# EAGLE design Group 1-1_PP (EAGLE 9.6.2)

## Sheet 1 of 2
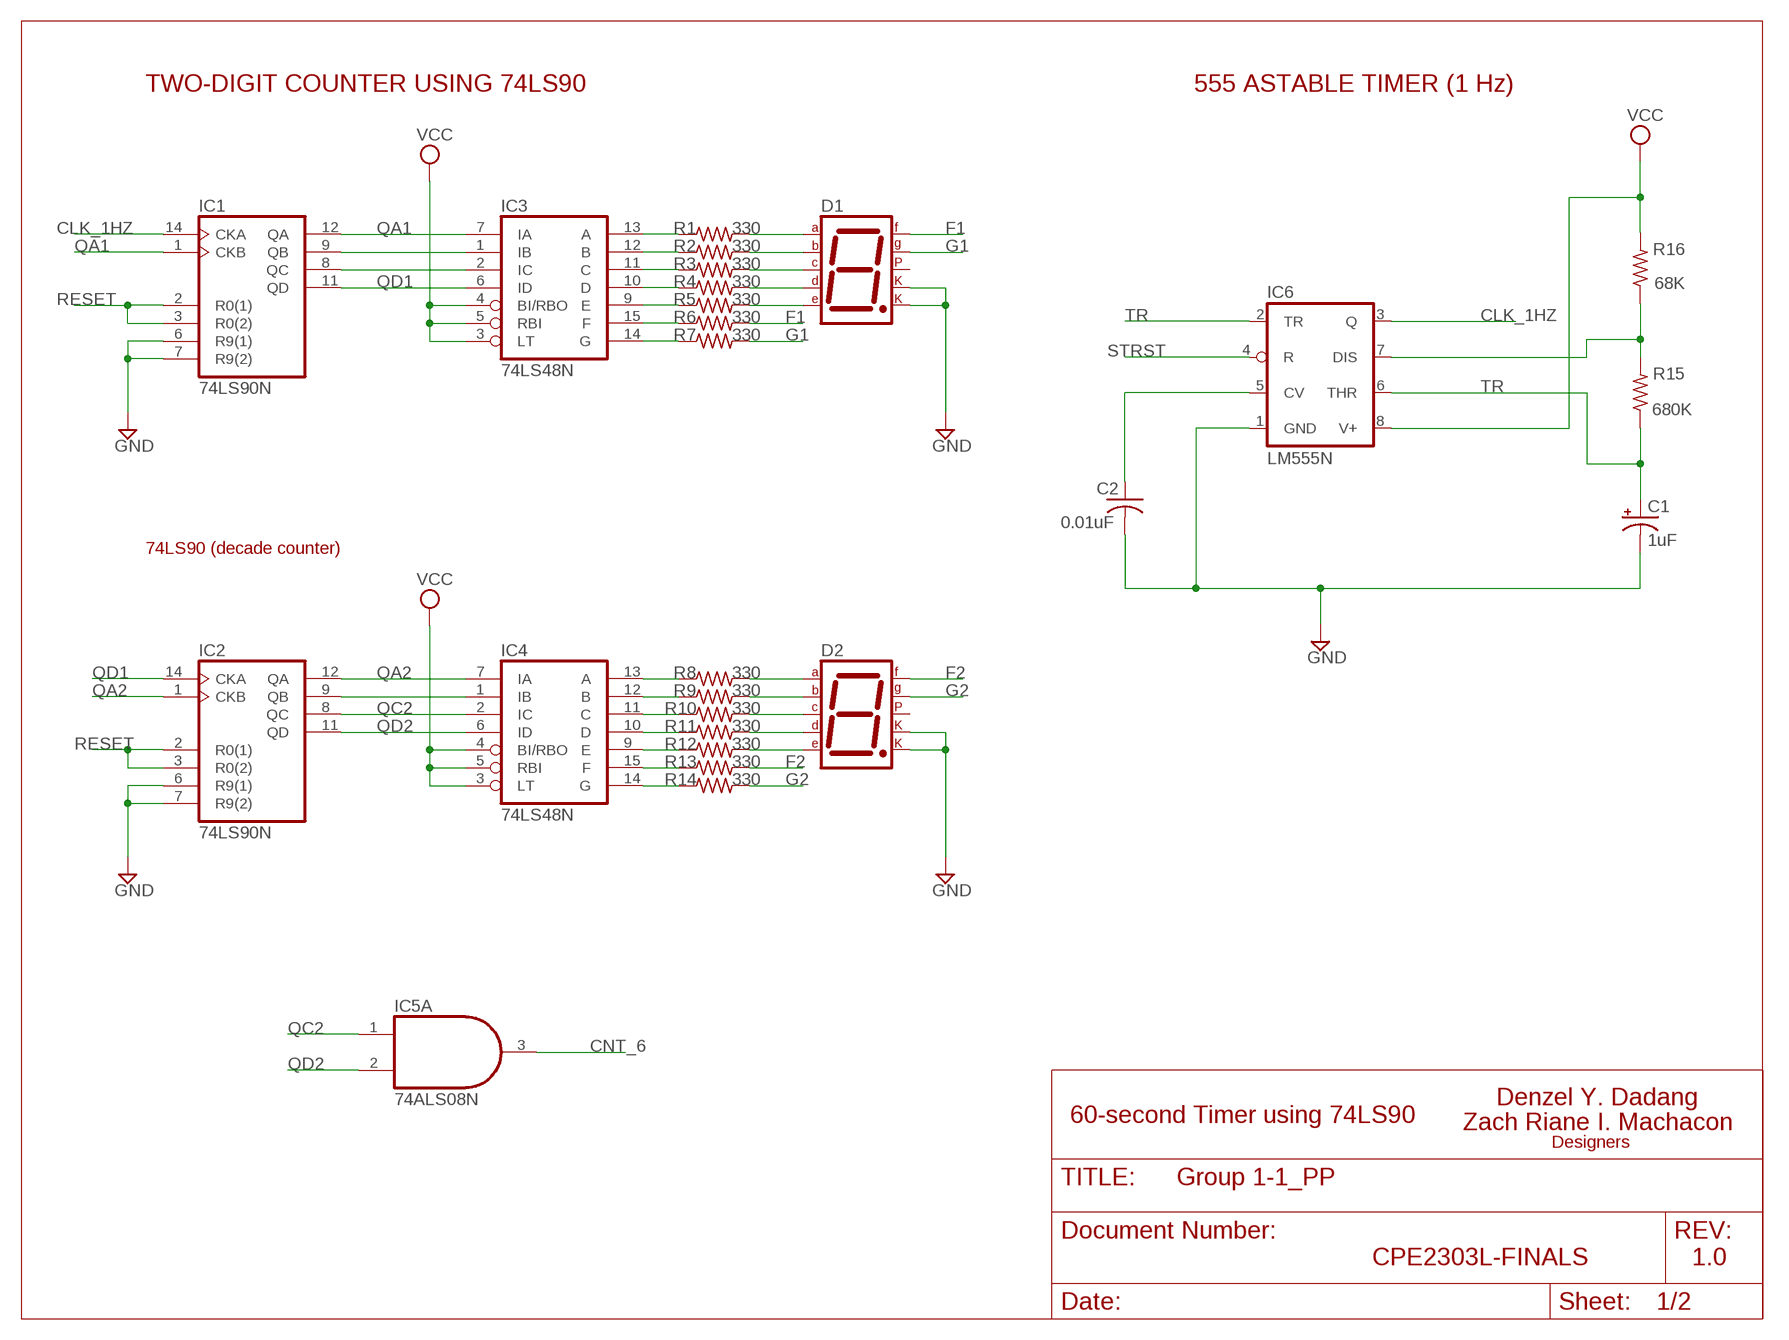
[diagram p0: schematic, sheet 1]

### Parts
C1  1uF  CPOL-USE1.8-4  [E1,8-4]
C2  0.01uF  C-US025-025X050  [C025-025X050]
D1  7SEG-CK  [7SEG-13]
D2  7SEG-CK  [7SEG-13]
IC1  74LS90N  [DIL14]
IC2  74LS90N  [DIL14]
IC3  74LS48N  [DIL16]
IC4  74LS48N  [DIL16]
IC5  74ALS08N  [DIL14]
IC6  LM555N  [DIL08]
R1  330  R-US_0204/7  [0204/7]
R2  330  R-US_0204/7  [0204/7]
R3  330  R-US_0204/7  [0204/7]
R4  330  R-US_0204/7  [0204/7]
R5  330  R-US_0204/7  [0204/7]
R6  330  R-US_0204/7  [0204/7]
R7  330  R-US_0204/7  [0204/7]
R8  330  R-US_0204/7  [0204/7]
R9  330  R-US_0204/7  [0204/7]
R10  330  R-US_0204/7  [0204/7]
R11  330  R-US_0204/7  [0204/7]
R12  330  R-US_0204/7  [0204/7]
R13  330  R-US_0204/7  [0204/7]
R14  330  R-US_0204/7  [0204/7]
R15  680K  R-US_0204/7  [0204/7]
R16  68K  R-US_0204/7  [0204/7]

### Nets
CLK_1HZ: IC1.14(CKA) IC6.3(Q)
CNT_6: IC5.3(A:O) ; also sheet 2
F1: D1.9(F) R6.2
F2: D2.9(F) R13.2
G1: D1.10(G) R7.2
G2: D2.10(G) R14.2
GND: C1.- C2.2 D1.3(CK1) D1.8(CK2) D2.3(CK1) D2.8(CK2) IC1.6(R9(1)) IC1.7(R9(2)) IC2.6(R9(1)) IC2.7(R9(2)) IC6.1(GND) ; also sheet 2
N$6: IC3.13(A) R1.1
N$7: IC6.7(DIS) R15.2 R16.1
N$8: IC1.9(QB) IC3.1(IB)
N$9: C2.1 IC6.5(CV)
N$10: IC1.8(QC) IC3.2(IC)
N$11: IC3.12(B) R2.1
N$12: IC3.11(C) R3.1
N$13: IC3.10(D) R4.1
N$14: IC3.9(E) R5.1
N$15: IC3.15(F) R6.1
N$16: IC3.14(G) R7.1
N$17: IC4.13(A) R8.1
N$18: IC2.9(QB) IC4.1(IB)
N$19: D1.1(E) R5.2
N$20: D1.2(D) R4.2
N$21: D1.4(C) R3.2
N$22: D1.6(B) R2.2
N$23: D1.7(A) R1.2
N$24: IC4.12(B) R9.1
N$25: IC4.11(C) R10.1
N$26: IC4.10(D) R11.1
N$27: IC4.9(E) R12.1
N$28: IC4.15(F) R13.1
N$29: IC4.14(G) R14.1
N$30: D2.7(A) R8.2
N$31: D2.6(B) R9.2
N$32: D2.4(C) R10.2
N$33: D2.2(D) R11.2
N$34: D2.1(E) R12.2
QA1: IC1.1(CKB) IC1.12(QA) IC3.7(IA)
QA2: IC2.1(CKB) IC2.12(QA) IC4.7(IA)
QC2: IC2.8(QC) IC4.2(IC) IC5.1(A:I0)
QD1: IC1.11(QD) IC2.14(CKA) IC3.6(ID)
QD2: IC2.11(QD) IC4.6(ID) IC5.2(A:I1)
RESET: IC1.2(R0(1)) IC1.3(R0(2)) IC2.2(R0(1)) IC2.3(R0(2)) ; also sheet 2
STRST: IC6.4(R) ; also sheet 2
TR: C1.+ IC6.2(TR) IC6.6(THR) R15.1
VCC: IC3.3(LT) IC3.4(BI/RBO) IC3.5(RBI) IC4.3(LT) IC4.4(BI/RBO) IC4.5(RBI) IC6.8(V+) R16.2 ; also sheet 2
Unconnected: D1.5(DP) D2.5(DP) IC5.4(B:I0) IC5.5(B:I1) IC5.6(B:O) IC5.8(C:O) IC5.9(C:I0) IC5.10(C:I1) IC5.11(D:O) IC5.12(D:I0) IC5.13(D:I1)

### Notes on the sheet
- TWO-DIGIT COUNTER USING 74LS90 | 555 ASTABLE TIMER (1 Hz)
- 74LS90 (decade counter)
- Denzel Y. Dadang
- 60-second Timer using 74LS90
- Zach Riane I. Machacon
- Designers
- CPE2303L-FINALS | 1.0

## Sheet 2 of 2
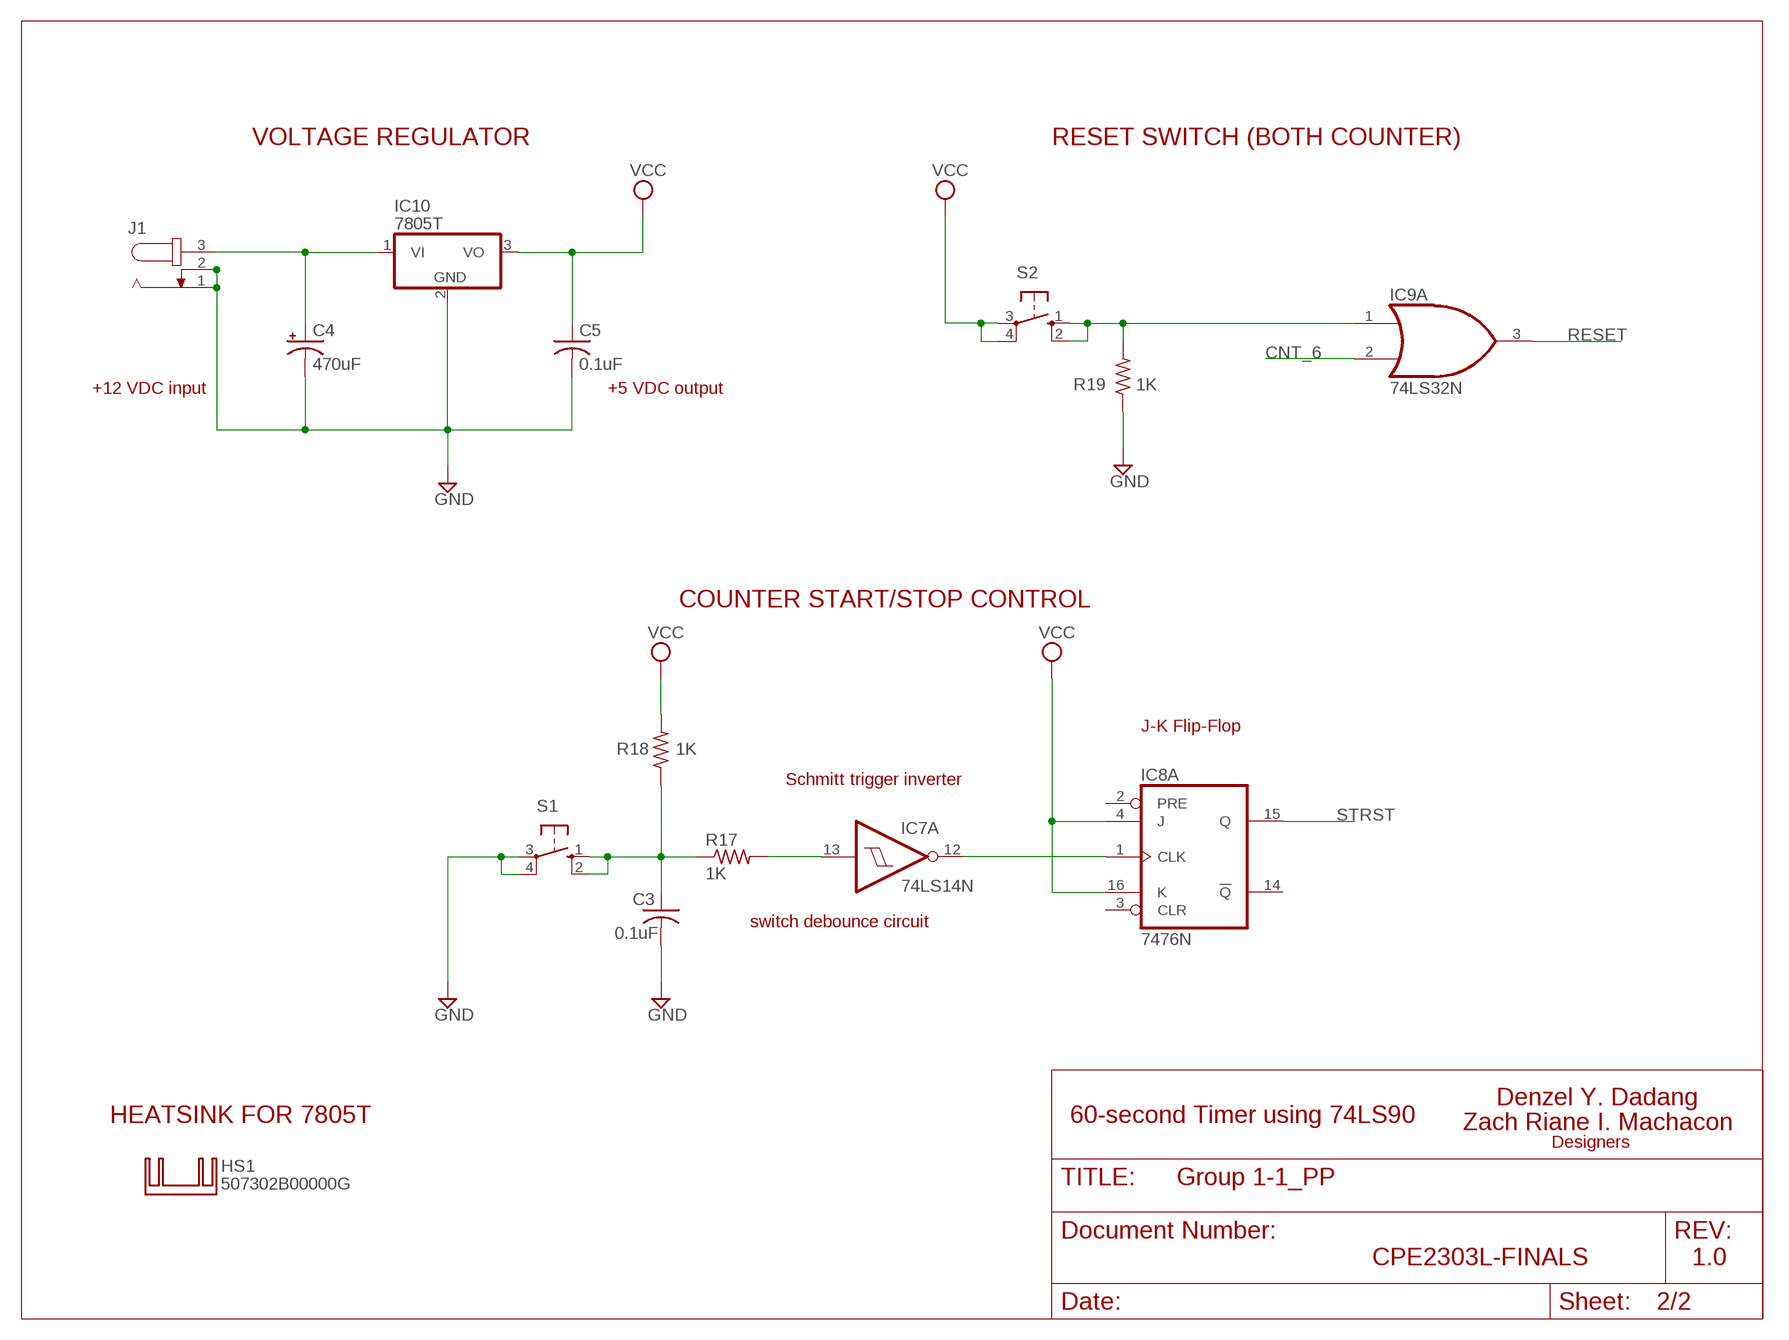
[diagram p1: schematic, sheet 2]

### Parts
C3  0.1uF  C-US025-025X050  [C025-025X050]
C4  470uF  CPOL-USE1.8-4  [E1,8-4]
C5  0.1uF  C-US025-025X050  [C025-025X050]
HS1  507302B00000G  [TO-220H]
IC7  74LS14N  [DIL14]
IC8  7476N  [DIL16]
IC9  74LS32N  [DIL14]
IC10  7805T  [TO220H]
J1  JACK-PLUG1  [SPC4078]
R17  1K  R-US_0204/7  [0204/7]
R18  1K  R-US_0204/7  [0204/7]
R19  1K  R-US_0204/7  [0204/7]
S1  10-XX  [B3F-10XX]
S2  10-XX  [B3F-10XX]

### Nets
CNT_6: IC9.2(A:I1) ; also sheet 1
GND: C3.2 C4.- C5.2 IC10.2(GND) J1.1 J1.2 R19.1 S1.3(P) S1.4(P1) ; also sheet 1
N$1: C4.+ IC10.1(VI) J1.3
N$2: IC7.12(A:O) IC8.1(A:CLK)
N$3: IC7.13(A:I) R17.2
N$4: C3.1 R17.1 R18.1 S1.1(S) S1.2(S1)
N$5: IC9.1(A:I0) R19.2 S2.1(S) S2.2(S1)
RESET: IC9.3(A:O) ; also sheet 1
STRST: IC8.15(A:Q) ; also sheet 1
VCC: C5.1 IC8.4(A:J) IC8.16(A:K) IC10.3(VO) R18.2 S2.3(P) S2.4(P1) ; also sheet 1
Unconnected: IC7.1(D:I) IC7.2(D:O) IC7.3(E:I) IC7.4(E:O) IC7.5(F:I) IC7.6(F:O) IC7.8(C:O) IC7.9(C:I) IC7.10(B:O) IC7.11(B:I) IC8.2(A:PRE) IC8.3(A:CLR) IC8.6(B:CLK) IC8.7(B:PRE) IC8.8(B:CLR) IC8.9(B:J) IC8.10(B:!Q) IC8.11(B:Q) IC8.12(B:K) IC8.14(A:!Q) IC9.4(B:I0) IC9.5(B:I1) IC9.6(B:O) IC9.8(C:O) IC9.9(C:I0) IC9.10(C:I1) IC9.11(D:O) IC9.12(D:I0) IC9.13(D:I1)

### Notes on the sheet
- VOLTAGE REGULATOR | RESET SWITCH (BOTH COUNTER)
- +12 VDC input | +5 VDC output
- COUNTER START/STOP CONTROL
- J-K Flip-Flop
- Schmitt trigger inverter
- switch debounce circuit
- Denzel Y. Dadang
- HEATSINK FOR 7805T | 60-second Timer using 74LS90
- Zach Riane I. Machacon
- Designers
- CPE2303L-FINALS | 1.0

## Power pins joined to a net without a drawn wire
GND: IC1.10(GND) IC2.10(GND) IC3.8(GND) IC4.8(GND) IC5.7(P:GND) IC7.7(P:GND) IC8.13(P:GND) IC9.7(P:GND)
VCC: IC1.5(VCC) IC2.5(VCC) IC3.16(VCC) IC4.16(VCC) IC5.14(P:VCC) IC7.14(P:VCC) IC8.5(P:VCC) IC9.14(P:VCC)

## Library data of the parts
C1 C4 = rcl:CPOL-US: POLARIZED CAPACITOR, American symbol; SPICEPREFIX: C
C2 C3 C5 = rcl:C-US: CAPACITOR, American symbol; SPICEPREFIX: C
D1 D2 = special:7SEG-CK: 7-segment DISPLAY single cathode, 13 mm
HS1 = to220-heatsink:507302B00000G
IC1 IC2 = 74xx-us:74*90: Decade, divide by twelve and binary COUNTER
IC3 IC4 = 74xx-us:74*48: BCD to seven segment DECODER/DRIVER
IC5 = 74xx-us:74*08: Quad 2-input AND gate
IC6 = linear:*555: TIMER
IC7 = 74xx-us:74*14: Hex schmitt trigger INVERTER
IC8 = 74xx-us:74*76: Dual J-K FLIP FLOP, preset and clear
IC9 = 74xx-us:74*32: Quad 2-input OR gate
IC10 = linear:78*: Positive VOLTAGE REGULATOR Source: http://cache.national.com/ds/LM/LM78L05.pdf http://www.fairchildsemi.com/ds/LM/LM7805.pdf
J1 = con-jack:JACK-PLUG: DC POWER JACK Power Jack, DC, Right Angle, Through Hole, Rated 5A at 16VDC, PC Terminals Distributor: Farnell (www.Farnell.de) Drawing: 84N1161.pdf / 84N1162.pdf Manufacturer: SPC Technology (www.spctechnology.com) Type: SPC4077 / SPC 4078; OC_FARNELL: unknown; OC_NEWARK: unknown
R1-R19 = rcl:R-US_: RESISTOR, American symbol; SPICEPREFIX: R
S1 S2 = switch-omron:10-XX: OMRON SWITCH; MPN: B3F-1000; OC_FARNELL: 176432; OC_NEWARK: 36M3542

## Board
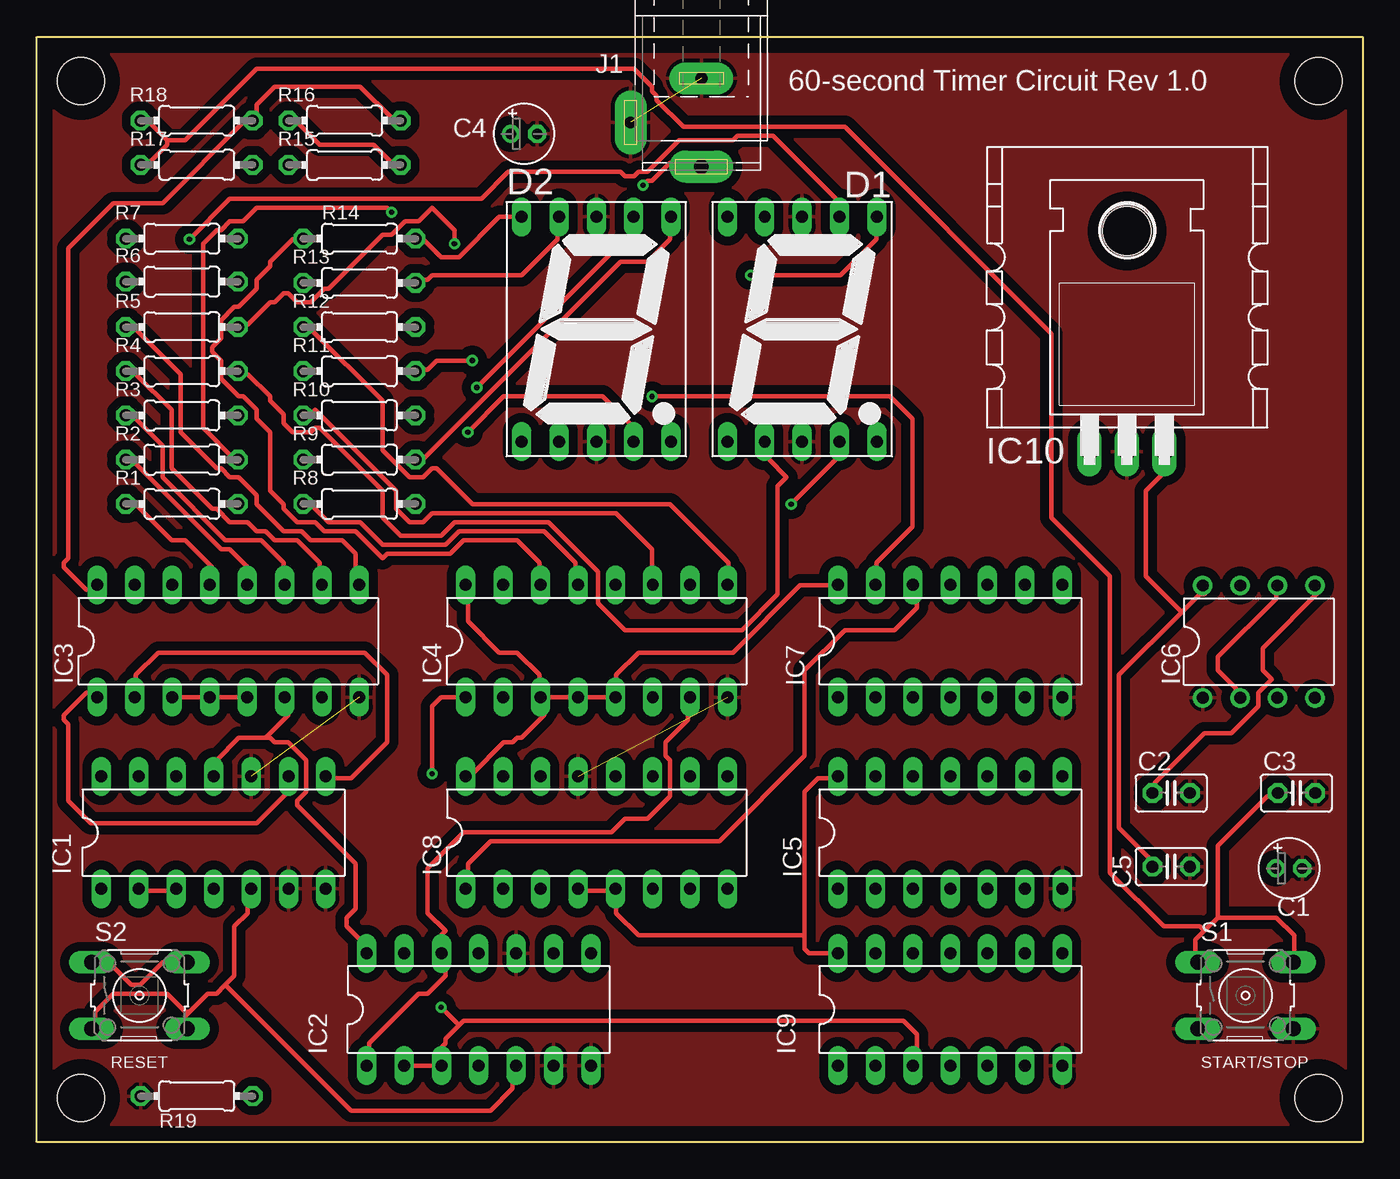
[diagram p2: board, top side]
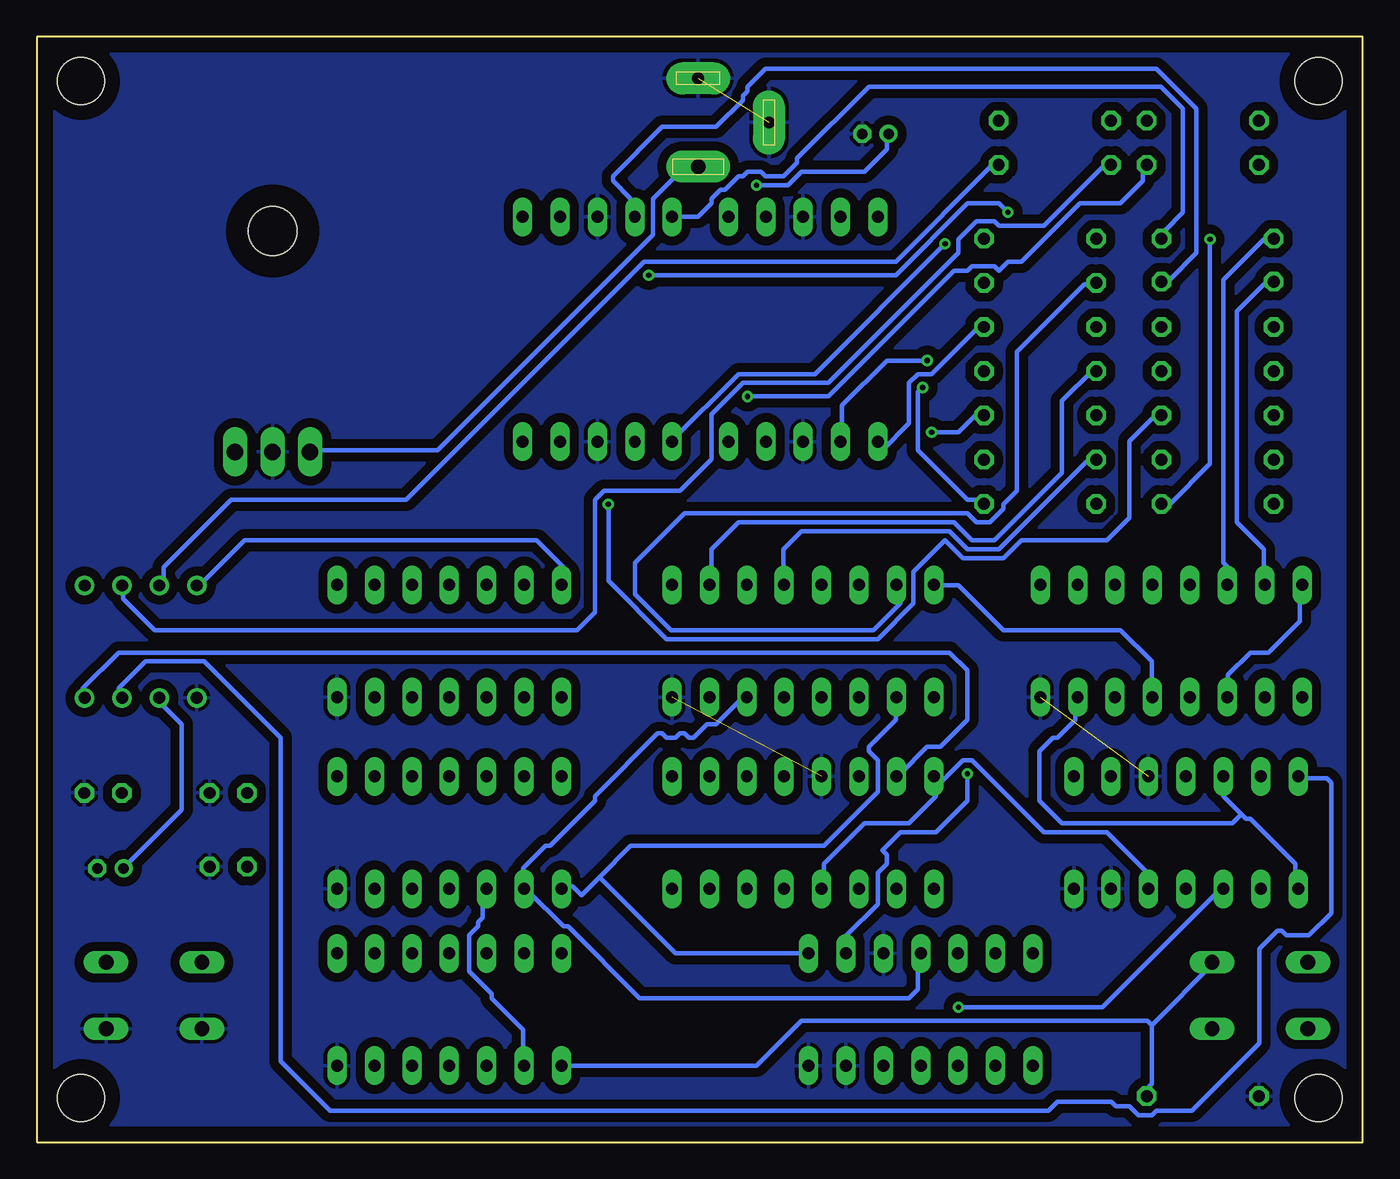
[diagram p3: board, bottom side, seen from below]

Size 90 x 75 mm. Coordinates in mm from the lower left corner, seen from the top.
Outline: 0,0 0,75 90,75 90,0 0,0
Copper layers (1*16): Top 0.035mm / dielectric 1.53mm / Bottom 0.035mm
Design rules "default *": minimum track width 12mil, minimum drill 0.35mm, track to track 12mil, track to pad 12mil, pad to pad 12mil, via to via 12mil, smd to smd 12mil, copper to edge 40mil, drill to drill 8mil, minimum pad ring 10mil, minimum via ring 8mil, stop-mask expansion 4mil, vias tented up to drill 0mil, thermal gap 10mil
Holes 3.2 mm at 3,72 3,3 87,3 87,72

### Footprints (pad centres in the part's own frame; a part is rotated, then mirrored left to right if it is on the bottom)
E1,8-4 = drill 0.711 pad 1.168: + -0.889,0 | drill 0.711 pad 1.168 octagon: - 0.889,0
C025-025X050 = drill 0.813 octagon: 1 -1.27,0; 2 1.27,0
7SEG-13 = drill 0.813 long: 1 -5.08,-7.62; 2 -2.54,-7.62; 3 0,-7.62; 4 2.54,-7.62; 5 5.08,-7.62; 6 5.08,7.62; 7 2.54,7.62; 8 0,7.62; 9 -2.54,7.62; 10 -5.08,7.62
DIL14 = drill 0.813 long: 1 -7.62,-3.81; 2 -5.08,-3.81; 3 -2.54,-3.81; 4 0,-3.81; 5 2.54,-3.81; 6 5.08,-3.81; 7 7.62,-3.81; 8 7.62,3.81; 9 5.08,3.81; 10 2.54,3.81; 11 0,3.81; 12 -2.54,3.81; 13 -5.08,3.81; 14 -7.62,3.81
DIL16 = drill 0.813 long: 1 -8.89,-3.81; 2 -6.35,-3.81; 3 -3.81,-3.81; 4 -1.27,-3.81; 5 1.27,-3.81; 6 3.81,-3.81; 7 6.35,-3.81; 8 8.89,-3.81; 9 8.89,3.81; 10 6.35,3.81; 11 3.81,3.81; 12 1.27,3.81; 13 -1.27,3.81; 14 -3.81,3.81; 15 -6.35,3.81; 16 -8.89,3.81
DIL08 = drill 0.813 pad 1.27: 1 -3.81,-3.81; 2 -1.27,-3.81; 3 1.27,-3.81; 4 3.81,-3.81; 5 3.81,3.81; 6 1.27,3.81; 7 -1.27,3.81; 8 -3.81,3.81
TO220H = drill 1.118 long: 1 -2.54,-10.16; 2 0,-10.16; 3 2.54,-10.16 | hole 3.302: 0,4.826
SPC4078 = drill 0.8 pad 2.184 long: 1 -3,0; 2 0,-4.8 | drill 1 pad 2.184 long: 3 3,0
0204/7 = drill 0.813 octagon: 1 -3.81,0; 2 3.81,0
B3F-10XX = drill 1.016 long: 1 -3.251,2.261; 2 3.251,2.261; 3 -3.251,-2.261; 4 3.251,-2.261

### Placement (x,y rotation side)
C1  85,18.58 0 top
C2  77,23.69 0 top
C3  85.5,23.69 0 top
C4  33.07,68.42 0 top
C5  77,18.69 0 top
D1  51.95,55.16 0 top
D2  37.98,55.16 0 top
HS1  64.5,58 270 top
IC1  12,21 0 top
IC2  30,9 0 top
IC3  13,34 0 top
IC4  38,34 0 top
IC5  62,21 0 top
IC6  82.95,33.96 0 top
IC7  62,34 0 top
IC8  38,21 0 top
IC9  62,9 0 top
IC10  74,57 0 top
J1  45.11,69.19 270 top
R1  9.85,43.31 0 top
R2  9.85,46.31 0 top
R3  9.85,49.31 0 top
R4  9.85,52.31 0 top
R5  9.85,55.31 0 top
R6  9.85,58.39 0 top
R7  9.85,61.31 0 top
R8  21.9,43.31 0 top
R9  21.9,46.31 0 top
R10  21.9,49.31 0 top
R11  21.9,52.31 0 top
R12  21.9,55.31 0 top
R13  21.9,58.31 0 top
R14  21.9,61.31 0 top
R15  20.9,66.31 0 top
R16  20.9,69.31 0 top
R17  10.85,66.31 0 top
R18  10.85,69.31 0 top
R19  10.86,3.13 0 top
S1  82.04,9.96 0 top
S2  6.97,9.96 0 top

### Tracks (layer width: path | path; a pad name or v marks a point on that pad's centre or on a via)
CLK_1HZ
  Bottom 0.305: IC1.14 4.27,24.69 2.44,24.69 2.13,24.38 2.13,15.54 3.66,14.02 5.18,14.02 5.49,14.33 5.79,14.33 7.01,13.11 7.01,6.71 11.58,2.13 14.02,2.13 14.33,1.83 15.24,1.83 15.85,2.44 16.76,2.44 17.07,2.74 20.73,2.74 21.34,2.13 70.1,2.13 73.46,5.49 73.46,27.43 78.64,32.61 82.6,32.61 84.43,30.79 84.43,30.18 IC6.3
CNT_6
  Bottom 0.305: IC9.2 57,5.49 57,7.62 59.13,9.75 59.13,10.06 60.66,11.58 60.66,14.02 60.05,14.63 60.05,14.94 59.74,15.24 59.74,17.07 IC5.3
F1
  Bottom 0.305: R6.2 13.41,58.52 13.11,58.52 11.28,60.35 11.28,70.1 14.02,72.85 40.54,72.85 41.76,71.63 41.76,71.32 42.06,71.02 42.06,70.71 43.89,68.89 47.55,68.89 50.9,65.53 50.9,65.23 49.68,64.01 49.68,62.79 D1.9
F2
  Top 0.305: R13.2 25.91,58.52 26.52,58.52 26.82,58.83 32.92,58.83 35.36,61.27 35.36,62.48 D2.9
G1
  Bottom 0.305: R7.2 13.41,61.57 13.41,61.87 12.19,63.09 12.19,70.1 13.72,71.63 33.53,71.63 38.41,66.75 38.41,66.45 39.32,65.53 40.54,65.53 40.84,65.84 41.76,65.84 42.06,65.53 42.37,65.53 43.28,64.62 43.59,64.62 44.2,64.01 44.2,63.7 45.11,62.79 46.63,62.79 D1.10
G2
  Top 0.305: R14.2 25.91,61.27 26.21,61.27 27.43,60.05 28.65,60.05 31.39,62.79 32.61,62.79 D2.10
GND  (3 unrouted)
  pour Top (isolate 0.61): 0,74.98 89.81,74.98 90.02,74.98 90.02,0 0,0
  pour Bottom (isolate 0.61): 0,74.98 90.02,74.98 90.02,0 0,0
N$1  (via drill 0.35)
  Top 0.305: v41.15,64.92 41.45,65.23 41.76,65.23 42.98,66.45 45.11,66.45 J1.3
  Bottom 0.305: v41.15,64.92 39.01,64.92 38.1,65.84 33.83,65.84 32.31,67.36 32.31,68.28 C4.+ | IC10.1 71.32,46.94 62.79,46.94 48.16,61.57 48.16,64.01 46.02,66.14 45.11,66.14 J1.3
N$2
  Top 0.305: IC8.1 29.26,17.37 29.26,18.9 30.79,20.42 46.33,20.42 52.12,26.21 52.12,32 54.86,34.75 58.22,34.75 59.74,36.27 59.74,37.8 IC7.12
N$3  (via drill 0.35)
  Top 0.305: v41.76,50.6 57.91,50.6 59.44,49.07 59.44,41.76 57,39.32 57,38.1 IC7.13
  Bottom 0.305: v41.76,50.6 36.27,50.6 27.74,59.13 26.82,59.13 26.52,59.44 24.99,59.44 24.69,59.13 24.08,59.74 23.16,59.74 19.2,63.7 16.46,63.7 14.94,65.23 14.94,66.14 R17.2
N$4
  Top 0.305: 8.84,67.97 8.84,67.67 7.62,66.45 7.32,66.45 R17.1 | 8.84,67.97 7.32,69.49 R18.1 | 80.16,15.24 80.16,20.12 83.52,23.47 84.12,23.47 C3.1 | 79.25,14.33 78.64,13.72 78.64,12.5 S1.1 | 79.25,14.33 80.16,15.24 | 80.16,15.24 84.12,15.24 85.34,14.02 85.34,12.5 S1.2 | 8.84,67.97 10.06,67.97 14.94,72.85 40.54,72.85 41.76,71.63 41.76,71.32 42.06,71.02 42.06,70.71 43.89,68.89 54.86,68.89 68.89,54.86 68.89,42.37 72.85,38.41 72.85,18.29 76.5,14.63 78.94,14.63 79.25,14.33
N$5
  Top 0.305: S2.1 3.96,12.19 4.88,12.19 6.4,10.67 7.01,10.67 8.53,12.19 10.06,12.19 S2.2
  Bottom 0.305: 14.33,7.92 14.33,3.96 14.63,3.66 14.63,3.35 R19.2 | 14.33,7.92 10.06,12.19 S2.2 | 14.33,7.92 14.63,8.23 38.1,8.23 41.15,5.18 54.25,5.18 IC9.1
N$6
  Top 0.305: R1.1 6.1,43.28 6.71,43.28 9.14,40.84 10.06,40.84 11.89,39.01 11.89,38.1 IC3.13
N$7
  Top 0.305: R16.1 17.37,69.19 17.68,69.19 19.2,67.67 22.86,67.67 24.08,66.45 24.69,66.45 R15.2
  Bottom 0.305: IC6.7 81.38,37.8 81.38,39.01 76.81,43.59 64.92,43.59 48.77,59.74 31.7,59.74 25.3,66.14 24.99,65.84 24.69,65.84 24.69,66.14 R15.2
N$8
  Top 0.305: IC1.9 17.07,24.69 17.07,23.77 14.94,21.64 3.66,21.64 2.13,23.16 2.13,28.35 1.83,28.65 1.83,28.96 3.35,30.48 3.96,30.48 IC3.1
N$9
  Top 0.305: C2.1 75.89,23.77 75.89,24.38 79.25,27.74 81.08,27.74 82.91,29.57 82.91,30.48 83.82,31.39 83.21,32 83.21,33.53 87.17,37.49 86.87,37.8 IC6.5
N$10
  Top 0.305: IC1.8 19.81,24.69 21.34,24.69 23.77,27.13 23.77,31.7 22.25,33.22 8.23,33.22 6.71,31.7 6.71,30.48 IC3.2
N$11
  Top 0.305: R2.1 6.1,46.02 6.71,46.02 12.5,40.23 13.11,40.23 14.33,39.01 14.33,38.1 IC3.12
N$12
  Top 0.305: IC3.11 16.76,38.1 16.76,39.32 15.24,40.84 12.8,40.84 8.53,45.11 8.53,47.24 6.71,49.07 6.1,49.07 R3.1
N$13
  Top 0.305: IC3.10 19.2,38.1 19.2,39.32 17.68,40.84 16.15,40.84 15.54,41.45 14.94,41.45 14.33,42.06 13.11,42.06 12.19,42.98 11.89,42.98 9.14,45.72 9.14,49.68 6.71,52.12 6.1,52.12 R4.1
N$14
  Top 0.305: IC3.9 21.64,38.1 21.64,39.93 20.73,40.84 18.59,40.84 17.98,41.45 16.76,41.45 14.94,43.28 14.94,43.89 13.72,45.11 13.11,45.11 12.5,45.72 12.19,45.72 9.75,48.16 9.75,52.12 6.71,55.17 6.1,55.17 R5.1
N$15
  Bottom 0.305: IC3.15 6.71,38.1 6.71,40.23 8.53,42.06 8.53,56.39 6.71,58.22 6.1,58.22 R6.1
N$16
  Bottom 0.305: R7.1 6.1,61.27 6.71,61.27 9.45,58.52 9.45,39.32 9.14,39.01 9.14,38.1 IC3.14
N$17
  Top 0.305: IC4.13 36.58,38.1 36.58,39.32 34.44,41.45 28.65,41.45 27.74,40.54 23.47,40.54 21.95,42.06 19.81,42.06 18.29,43.59 R8.1
N$18  (via drill 0.35)
  Top 0.305: v26.82,24.99 26.82,29.57 27.43,30.18 28.96,30.18 IC4.1
  Bottom 0.305: v26.82,24.99 26.82,23.16 28.96,21.03 31.39,21.03 32.61,19.81 32.31,19.51 32.31,18.9 32.92,18.29 32.92,16.15 35.05,14.02 35.05,13.11 IC2.9
N$19  (via drill 0.35)
  Top 0.305: v28.35,60.96 28.35,61.87 26.82,63.4 25.91,62.48 24.99,62.48 24.08,61.57 23.47,61.57 19.81,57.91 19.51,57.91 18.59,57 17.68,57 17.07,57.61 16.76,57.61 16.15,57 15.85,57 14.33,55.47 13.72,55.47 R5.2
  Bottom 0.305: v28.35,60.96 37.19,52.12 42.37,52.12 46.94,47.55 D1.1
N$20
  Top 0.305: R4.2 13.72,52.12 14.33,52.12 15.85,50.6 15.85,50.29 16.76,49.38 16.76,48.77 17.37,48.16 18.59,48.16 18.9,48.46 19.2,48.46 23.47,44.2 23.47,42.37 24.69,41.15 27.43,41.15 28.35,42.06 34.75,42.06 38.1,38.71 38.1,36.58 39.93,34.75 47.85,34.75 50.29,37.19 50.29,44.5 50.9,45.11 49.68,46.33 49.68,47.24 D1.2
N$21  (via drill 0.35)
  Top 0.305: v51.21,43.28 54.25,46.33 54.25,47.24 D1.4
  Bottom 0.305: v51.21,43.28 51.21,38.1 47.24,34.14 32.92,34.14 30.48,36.58 30.48,38.71 28.35,40.84 27.13,39.62 24.38,39.62 23.16,40.84 17.37,40.84 15.85,42.37 15.85,47.55 14.33,49.07 13.72,49.07 R3.2
N$22  (via drill 0.35)
  Top 0.305: v24.08,63.09 23.77,63.4 14.94,63.4 14.02,62.48 13.11,62.48 12.5,61.87 12.19,61.87 11.28,60.96 11.28,48.46 13.41,46.33 R2.2 | v48.46,58.83 54.56,58.83 57,61.27 57,62.48 D1.6
  Bottom 0.305: v24.08,63.09 24.69,63.7 26.82,63.7 31.7,58.83 v48.46,58.83
N$23  (via drill 0.35)
  Top 0.305: v10.36,61.27 13.11,64.01 30.18,64.01 32,65.84 39.62,65.84 39.93,65.53 40.54,65.53 40.84,65.84 41.45,65.84 43.59,67.97 47.24,67.97 47.55,68.28 49.99,68.28 54.25,64.01 54.25,62.79 D1.7
  Bottom 0.305: v10.36,61.27 10.36,46.02 13.11,43.28 13.41,43.28 R1.2
N$24
  Bottom 0.305: IC4.12 39.32,38.1 39.32,40.23 38.1,41.45 28.04,41.45 26.82,40.23 24.69,40.23 18.59,46.33 18.29,46.33 R9.1
N$25
  Top 0.305: IC4.11 41.76,38.1 41.76,40.23 39.32,42.67 26.82,42.67 26.21,42.06 25.3,42.06 24.38,42.98 24.38,44.2 18.9,49.68 18.29,49.07 R10.1
N$26
  Bottom 0.305: IC4.10 44.2,38.1 44.2,40.23 42.37,42.06 27.74,42.06 26.52,40.84 24.99,40.84 20.42,45.41 20.42,50.29 18.29,52.43 R11.1
N$27
  Top 0.305: R12.1 18.29,55.17 18.59,55.17 23.47,50.29 23.47,46.94 25.3,45.11 26.21,45.11 26.82,45.72 27.13,45.72 29.57,43.28 42.98,43.28 46.94,39.32 46.94,38.1 IC4.9
N$28
  Bottom 0.305: R13.1 18.29,58.22 18.9,58.22 23.47,53.65 23.47,44.2 24.38,43.28 24.38,42.98 25.3,42.06 26.21,42.06 26.82,42.67 46.02,42.67 49.38,39.32 49.38,37.19 46.94,34.75 33.22,34.75 31.39,36.58 31.39,37.8 IC4.15
N$29
  Top 0.305: R14.1 17.98,61.27 17.37,61.27 15.85,59.74 15.85,59.44 14.94,58.52 14.94,57.91 13.72,56.69 13.41,56.69 12.5,55.78 12.5,54.56 11.89,53.95 11.89,53.65 12.5,53.03 12.5,51.82 13.72,50.6 14.02,50.6 14.94,49.68 14.94,49.07 15.85,48.16 15.85,44.2 16.76,43.28 16.76,42.98 17.68,42.06 18.9,42.06 19.51,41.45 21.64,41.45 23.47,39.62 23.77,39.93 28.04,39.93 28.96,40.84 32.61,40.84 34.14,39.32 34.14,38.1 IC4.14
N$30  (via drill 0.35)
  Top 0.305: v29.87,51.21 40.23,61.57 40.23,62.48 D2.7
  Bottom 0.305: v29.87,51.21 30.18,50.9 30.18,46.94 26.82,43.59 25.91,43.59 R8.2
N$31
  Top 0.305: R9.2 25.91,46.33 26.21,46.33 39.62,59.74 41.45,59.74 42.98,61.27 42.98,62.48 D2.6
N$32  (via drill 0.35)
  Top 0.305: v29.26,48.16 31.7,50.6 38.41,50.6 40.23,48.77 40.23,47.55 D2.4
  Bottom 0.305: v29.26,48.16 27.43,48.16 26.21,49.38 25.91,49.38 R10.2
N$33  (via drill 0.35)
  Top 0.305: v29.57,53.03 27.13,53.03 26.52,52.43 25.91,52.43 R11.2
  Bottom 0.305: v29.57,53.03 32.31,53.03 35.36,49.99 35.36,47.55 D2.2
N$34
  Bottom 0.305: R12.2 25.91,55.17 26.21,55.17 29.26,52.12 30.18,52.12 30.79,51.51 30.79,48.77 32.61,46.94 32.92,47.24 D2.1
QA1
  Bottom 0.305: 8.23,22.25 9.45,23.47 9.45,24.69 IC1.12 | 8.23,22.25 7.92,21.95 7.62,21.95 4.57,18.9 4.57,17.37 IC1.1 | 8.23,22.25 8.84,21.64 20.42,21.64 21.95,23.16 21.95,26.52 21.03,27.43 20.73,27.43 19.51,28.65 19.51,30.18 IC3.7
QA2
  Top 0.305: IC2.1 22.55,5.49 22.55,6.71 25.91,10.06 26.52,10.06 27.74,11.28 27.74,12.8 IC2.12 27.43,13.11 27.43,14.02 27.74,14.33 26.52,15.54 26.52,18.59 28.96,21.03 39.01,21.03 39.93,21.95 41.45,21.95 42.98,23.47 42.98,25.91 42.67,26.21 42.67,27.13 44.2,28.65 44.2,30.18 IC4.7
QC2
  Bottom 0.305: 51.82,17.98 53.03,16.76 53.65,17.37 54.25,17.37 IC5.1 | 51.82,17.98 49.68,20.12 36.58,20.12 32.92,23.77 32.92,25.91 33.53,26.52 33.53,26.82 31.7,28.65 31.7,30.18 IC4.2 | 51.82,17.98 46.63,12.8 37.8,12.8 IC2.8
QD1
  Top 0.305: 15.54,27.43 13.72,27.43 12.19,25.91 12.19,24.99 IC1.11 | 15.54,27.43 17.07,28.96 17.07,30.18 IC3.6 | 15.54,27.43 15.85,27.43 16.15,27.13 17.07,27.13 18.29,25.91 18.29,23.77 17.68,23.16 17.68,22.86 21.64,18.9 21.64,15.85 21.03,15.24 21.03,14.63 22.25,13.41 22.25,13.11 IC2.14
QD2
  Bottom 0.305: IC2.11 30.18,12.8 30.18,10.36 30.79,9.75 49.07,9.75 53.95,14.63 54.25,14.63 56.69,17.07 IC5.2 57,17.37 57,18.59 55.47,20.12 55.17,20.12 52.12,23.16 52.12,23.47 47.85,27.74 47.55,27.74 47.24,27.43 46.63,27.43 46.33,27.74 46.02,27.74 45.72,27.43 45.41,27.43 44.5,28.35 43.89,28.35 42.06,30.18 IC4.6
RESET  (via drill 0.35)
  Top 0.305: IC1.2 7.01,17.07 9.45,17.07 IC1.3 | IC2.2 24.99,5.18 27.43,5.18 IC2.3 27.43,5.49 27.43,6.4 27.74,6.71 27.74,7.01 28.65,7.92 | 28.65,7.92 28.96,8.23 58.83,8.23 59.74,7.32 59.74,5.49 IC9.3 | 28.65,7.92 v27.43,9.14
  Bottom 0.305: v27.43,9.14 17.68,9.14 9.75,17.07 IC1.3
STRST
  Bottom 0.305: IC8.15 31.39,24.99 29.57,26.82 28.65,26.82 26.82,28.65 26.82,32 28.04,33.22 84.43,33.22 86.87,30.79 86.87,30.18 IC6.4
TR
  Top 0.305: IC6.2 81.38,30.18 81.38,30.79 80.16,32 80.16,32.92 84.12,36.88 84.12,37.19 83.82,37.49 84.12,37.8 IC6.6
  Bottom 0.305: C1.+ 83.82,18.59 83.82,18.9 80.16,22.55 80.16,28.35 81.69,29.87 IC6.2 | R15.1 17.37,66.14 17.68,66.14 21.64,62.18 24.69,62.18 24.99,62.48 26.21,62.48 27.43,61.27 27.43,60.35 36.27,51.51 42.06,51.51 44.2,49.38 44.2,46.33 46.33,44.2 51.51,44.2 52.12,43.59 52.12,35.97 53.34,34.75 81.99,34.75 84.12,36.88 84.12,37.19 83.82,37.49 84.12,37.8 IC6.6
VCC
  Top 0.305: R16.2 24.69,69.49 24.08,69.49 21.95,71.63 16.15,71.63 14.94,70.41 14.94,69.49 R18.2 14.63,69.19 14.02,69.19 8.53,63.7 5.18,63.7 2.13,60.66 2.13,39.62 1.83,39.32 1.83,39.01 3.35,37.49 3.66,37.49 3.96,37.8 IC3.16 | IC3.3 9.45,30.18 11.58,30.18 IC3.4 11.89,30.18 14.02,30.18 IC3.5 | 12.8,10.67 12.19,10.06 11.58,10.06 10.36,8.84 | 12.8,10.67 13.41,11.28 13.41,14.63 14.33,15.54 14.33,17.07 IC1.5 | 10.36,8.84 10.06,8.53 10.06,7.92 S2.4 | 12.8,10.67 21.34,2.13 30.79,2.13 32.31,3.66 32.31,5.18 IC2.5 | 10.36,8.84 10.06,8.84 8.84,10.06 5.18,10.06 3.96,8.84 3.96,7.92 S2.3 | 77.72,35.97 78.94,37.19 79.25,37.19 79.55,37.49 79.25,37.8 IC6.8 | 77.72,35.97 73.46,31.7 73.46,21.34 75.59,19.2 75.59,18.9 C5.1 | 77.72,35.97 75.29,38.41 75.29,44.2 76.5,45.41 76.5,46.63 IC10.3 | IC8.4 36.88,17.07 39.01,17.07 IC8.5 39.32,17.07 39.32,15.54 40.84,14.02 52.12,14.02 | 52.12,14.02 52.12,23.77 53.03,24.69 54.25,24.69 IC5.14 | 52.12,14.02 52.12,13.11 52.43,12.8 54.25,12.8 IC9.14 | 34.44,30.18 34.44,28.96 32.92,27.43 32.61,27.43 32.31,27.13 31.7,27.13 29.57,24.99 29.26,24.99 IC8.16 | IC4.16 29.26,37.8 29.26,35.36 31.39,33.22 32.61,33.22 34.14,31.7 34.14,30.48 IC4.3 34.44,30.18 | IC7.14 54.25,37.8 51.82,37.8 47.24,33.22 40.84,33.22 39.32,31.7 39.32,30.48 IC4.5 39.01,30.18 36.88,30.18 IC4.4 36.58,30.18 34.44,30.18
  Bottom 0.305: IC3.16 4.27,37.8 4.27,35.36 6.4,33.22 7.62,33.22 9.14,31.7 9.14,30.48 IC3.3 | 28.96,24.08 28.96,24.69 IC8.16 28.96,24.08 | 28.96,24.08 28.96,23.47 30.79,21.64 33.83,21.64 36.58,18.9 36.58,17.37 IC8.4 | IC6.8 78.94,37.8 75.89,40.84 56.08,40.84 54.25,39.01 54.25,38.1 IC7.14 | 28.96,24.08 27.13,25.91 26.52,25.91 21.64,21.03 17.37,21.03 14.63,18.29 14.63,17.37 IC1.5 | IC3.5 14.33,30.48 14.33,32.61 16.46,34.75 24.38,34.75 27.43,37.8 28.96,37.8 IC4.16

### Text on the board
tNames: 60-second Timer Circuit Rev 1.0 | RESET | START/STOP